# Altium schematic sheet Connectors.SchDoc
size A4; CompanyName: Technische Hochschule Nürnberg Georg Simon Ohm; Organization: UltraZohm; Address1: Kesslerplatz 12; Address2: 90489 Nürnberg; Address3: GERMANY; DocumentNumber: 3; SheetNumber: 2; SheetTotal: 2; Website: www.ultrazohm.com
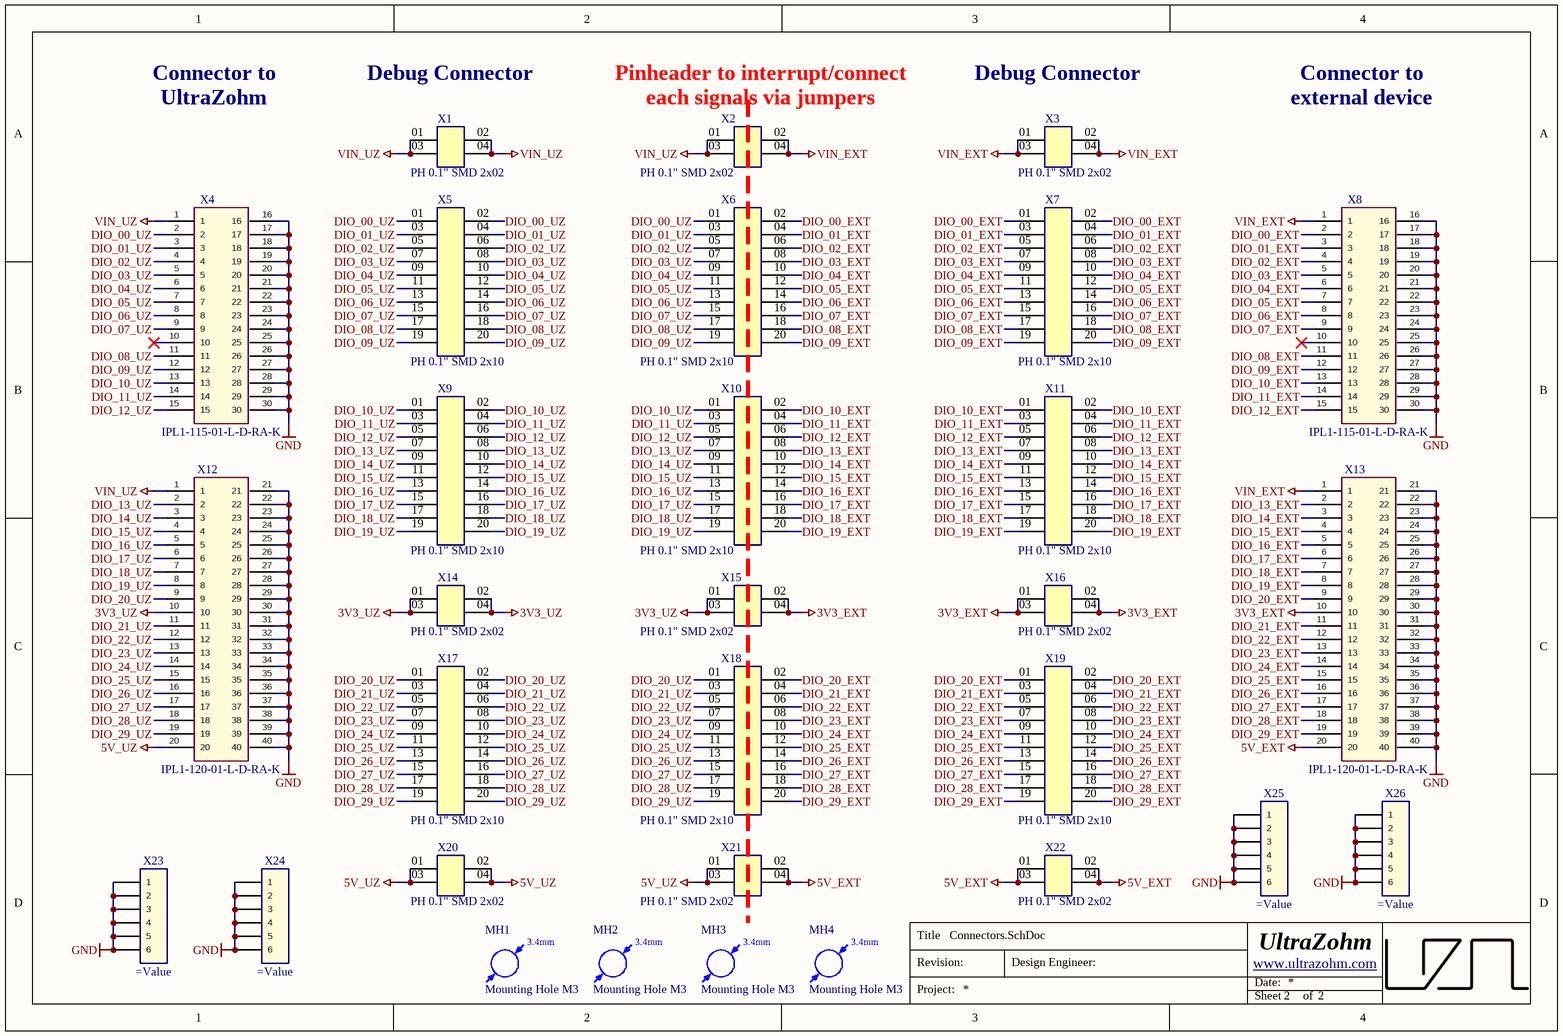
[diagram p0: Connectors.SchDoc]

## Parts
MH1  Mounting Hole M3  [MH_3.4]  (no BOM)
MH2  Mounting Hole M3  [MH_3.4]  (no BOM)
MH3  Mounting Hole M3  [MH_3.4]  (no BOM)
MH4  Mounting Hole M3  [MH_3.4]  (no BOM)
X1  PH 0.1" SMD 2x02  [TSM-102-01-L-DV]
X2  PH 0.1" SMD 2x02  [TSM-102-01-L-DV]
X3  PH 0.1" SMD 2x02  [TSM-102-01-L-DV]
X4  IPL1-115-01-L-D-RA-K  [IPL1-115-01-XX-D-RA]
X5  PH 0.1" SMD 2x10  [TSM-110-01-L-DV]
X6  PH 0.1" SMD 2x10  [TSM-110-01-L-DV]
X7  PH 0.1" SMD 2x10  [TSM-110-01-L-DV]
X8  IPL1-115-01-L-D-RA-K  [IPL1-115-01-XX-D-RA]
X9  PH 0.1" SMD 2x10  [TSM-110-01-L-DV]
X10  PH 0.1" SMD 2x10  [TSM-110-01-L-DV]
X11  PH 0.1" SMD 2x10  [TSM-110-01-L-DV]
X12  IPL1-120-01-L-D-RA-K  [IPL1-120-01-XX-D-RA]
X13  IPL1-120-01-L-D-RA-K  [IPL1-120-01-XX-D-RA]
X14  PH 0.1" SMD 2x02  [TSM-102-01-L-DV]
X15  PH 0.1" SMD 2x02  [TSM-102-01-L-DV]
X16  PH 0.1" SMD 2x02  [TSM-102-01-L-DV]
X17  PH 0.1" SMD 2x10  [TSM-110-01-L-DV]
X18  PH 0.1" SMD 2x10  [TSM-110-01-L-DV]
X19  PH 0.1" SMD 2x10  [TSM-110-01-L-DV]
X20  PH 0.1" SMD 2x02  [TSM-102-01-L-DV]
X21  PH 0.1" SMD 2x02  [TSM-102-01-L-DV]
X22  PH 0.1" SMD 2x02  [TSM-102-01-L-DV]
X23  (no value)  [TSW-106-XX-XXX-S]
X24  (no value)  [TSW-106-XX-XXX-S]
X25  (no value)  [TSW-106-XX-XXX-S]
X26  (no value)  [TSW-106-XX-XXX-S]

## Nets
3V3_EXT: X13.10 X15.02 X15.04 X16.01 X16.02 X16.03 X16.04
3V3_UZ: X12.10 X14.01 X14.02 X14.03 X14.04 X15.01 X15.03
5V_EXT: X13.20 X21.02 X21.04 X22.01 X22.02 X22.03 X22.04
5V_UZ: X12.20 X20.01 X20.02 X20.03 X20.04 X21.01 X21.03
GND: X4.16 X4.17 X4.18 X4.19 X4.20 X4.21 X4.22 X4.23 X4.24 X4.25 X4.26 X4.27 X4.28 X4.29 X4.30 X8.16 X8.17 X8.18 X8.19 X8.20 X8.21 X8.22 X8.23 X8.24 X8.25 X8.26 X8.27 X8.28 X8.29 X8.30 X12.21 X12.22 X12.23 X12.24 X12.25 X12.26 X12.27 X12.28 X12.29 X12.30 X12.31 X12.32 X12.33 X12.34 X12.35 X12.36 X12.37 X12.38 X12.39 X12.40 X13.21 X13.22 X13.23 X13.24 X13.25 X13.26 X13.27 X13.28 X13.29 X13.30 X13.31 X13.32 X13.33 X13.34 X13.35 X13.36 X13.37 X13.38 X13.39 X13.40 X23.1 X23.2 X23.3 X23.4 X23.5 X23.6 X24.1 X24.2 X24.3 X24.4 X24.5 X24.6 X25.1 X25.2 X25.3 X25.4 X25.5 X25.6 X26.1 X26.2 X26.3 X26.4 X26.5 X26.6
VIN_EXT: X2.02 X2.04 X3.01 X3.02 X3.03 X3.04 X8.1 X13.1
VIN_UZ: X1.01 X1.02 X1.03 X1.04 X2.01 X2.03 X4.1 X12.1
DIO_00_EXT: X6.02 X7.01 X7.02 X8.2
DIO_00_UZ: X4.2 X5.01 X5.02 X6.01
DIO_01_EXT: X6.04 X7.03 X7.04 X8.3
DIO_01_UZ: X4.3 X5.03 X5.04 X6.03
DIO_02_EXT: X6.06 X7.05 X7.06 X8.4
DIO_02_UZ: X4.4 X5.05 X5.06 X6.05
DIO_03_EXT: X6.08 X7.07 X7.08 X8.5
DIO_03_UZ: X4.5 X5.07 X5.08 X6.07
DIO_04_EXT: X6.10 X7.09 X7.10 X8.6
DIO_04_UZ: X4.6 X5.09 X5.10 X6.09
DIO_05_EXT: X6.12 X7.11 X7.12 X8.7
DIO_05_UZ: X4.7 X5.11 X5.12 X6.11
DIO_06_EXT: X6.14 X7.13 X7.14 X8.8
DIO_06_UZ: X4.8 X5.13 X5.14 X6.13
DIO_07_EXT: X6.16 X7.15 X7.16 X8.9
DIO_07_UZ: X4.9 X5.15 X5.16 X6.15
DIO_08_EXT: X6.18 X7.17 X7.18 X8.11
DIO_08_UZ: X4.11 X5.17 X5.18 X6.17
DIO_09_EXT: X6.20 X7.19 X7.20 X8.12
DIO_09_UZ: X4.12 X5.19 X5.20 X6.19
DIO_10_EXT: X8.13 X10.02 X11.01 X11.02
DIO_10_UZ: X4.13 X9.01 X9.02 X10.01
DIO_11_EXT: X8.14 X10.04 X11.03 X11.04
DIO_11_UZ: X4.14 X9.03 X9.04 X10.03
DIO_12_EXT: X8.15 X10.06 X11.05 X11.06
DIO_12_UZ: X4.15 X9.05 X9.06 X10.05
DIO_13_EXT: X10.08 X11.07 X11.08 X13.2
DIO_13_UZ: X9.07 X9.08 X10.07 X12.2
DIO_14_EXT: X10.10 X11.09 X11.10 X13.3
DIO_14_UZ: X9.09 X9.10 X10.09 X12.3
DIO_15_EXT: X10.12 X11.11 X11.12 X13.4
DIO_15_UZ: X9.11 X9.12 X10.11 X12.4
DIO_16_EXT: X10.14 X11.13 X11.14 X13.5
DIO_16_UZ: X9.13 X9.14 X10.13 X12.5
DIO_17_EXT: X10.16 X11.15 X11.16 X13.6
DIO_17_UZ: X9.15 X9.16 X10.15 X12.6
DIO_18_EXT: X10.18 X11.17 X11.18 X13.7
DIO_18_UZ: X9.17 X9.18 X10.17 X12.7
DIO_19_EXT: X10.20 X11.19 X11.20 X13.8
DIO_19_UZ: X9.19 X9.20 X10.19 X12.8
DIO_20_EXT: X13.9 X18.02 X19.01 X19.02
DIO_20_UZ: X12.9 X17.01 X17.02 X18.01
DIO_21_EXT: X13.11 X18.04 X19.03 X19.04
DIO_21_UZ: X12.11 X17.03 X17.04 X18.03
DIO_22_EXT: X13.12 X18.06 X19.05 X19.06
DIO_22_UZ: X12.12 X17.05 X17.06 X18.05
DIO_23_EXT: X13.13 X18.08 X19.07 X19.08
DIO_23_UZ: X12.13 X17.07 X17.08 X18.07
DIO_24_EXT: X13.14 X18.10 X19.09 X19.10
DIO_24_UZ: X12.14 X17.09 X17.10 X18.09
DIO_25_EXT: X13.15 X18.12 X19.11 X19.12
DIO_25_UZ: X12.15 X17.11 X17.12 X18.11
DIO_26_EXT: X13.16 X18.14 X19.13 X19.14
DIO_26_UZ: X12.16 X17.13 X17.14 X18.13
DIO_27_EXT: X13.17 X18.16 X19.15 X19.16
DIO_27_UZ: X12.17 X17.15 X17.16 X18.15
DIO_28_EXT: X13.18 X18.18 X19.17 X19.18
DIO_28_UZ: X12.18 X17.17 X17.18 X18.17
DIO_29_EXT: X13.19 X18.20 X19.19 X19.20
DIO_29_UZ: X12.19 X17.19 X17.20 X18.19

Not connected (* = marked no-connect by the designer): X4 10*; X8 10*

## Notes on the sheet
- Connector to UltraZohm
- Debug Connector
- (near X2) Pinheader to interrupt/connect each signals via jumpers
- Connector to external device
- Title
- Revision:
- Design Engineer:
- Date:
- Project:
- Sheet
- of
- (in symbol Mounting Hole) 3.4mm

## Library data of the parts
MH1-MH4 = Mounting Hole: Created from: MHlatky; Manufacturer Part Number: Mounting Hole M3; PartID: 16; Created On: 26.01.2021 09:19:51; ComponentLink1Description: Datasheet; Component Type: Mounting Hole; Device Package: -; Last Updated: 21.03.2022 23:05:12; Manufacturer: Mounting Hole; Supplier 1: Mounting Hole; Supplier Part Number 1: Mounting Hole; Type: Mounting Hole; Value: Mounting Hole; Live Cycle Status: 1; Stock number: not stored
X1-X3 X14-X16 X20-X22 = UZgen_Conn_PinHead_2x02_SMD_100mil_90deg: 0.1" Double-row Pin Header, 90°-to-PCB SMD, 2x02 Pins, 250V, 3A; Manufacturer: UZgen; Pin Pitch: 0.1" x 0.1"; Pin Orientation: 90° (standing); Created from: UZgenTool; Manufacturer Part Number: UZgen_Conn_PinHead_2x02_SMD_100mil_90deg; PartID: 1; Created On: 17.02.2025 17:01:00; Value: PH 0.1" SMD 2x02; Device Package: SMD 0.1" 2x02; Pin Count: 4; Pin Layout: 2x02; Pin Voltage: 250V; Pin Current: 3A; Mounting Type: SMD; Last Updated: 18.02.2025 11:20:45
X4 X8 = IPL1-115-01-L-D-RA-K: Terminal Assembly, Double Row, Right Angle, Thru-Hole, 2.54 mm x 2.54 mm Pitch, 30 Pins; Manufacturer: SAMTEC; Created from: TWendt; Number of positions: 30; Manufacturer Part Number: IPL1-115-01-L-D-RA-K; PartID: 34; Created On: 12.02.2021 15:31:18; ComponentLink1Description: Homepage; ComponentLink1URL: https://www.samtec.com/products/ipl1; Component Type: Samtec Connector; Device Package: Connector; Last Updated: 15.02.2021 10:07:42; Supplier 1: SAMTEC; Supplier Part Number 1: IPL1-115-01-L-D-RA-K; Type: Connector; Live Cycle Status: 1; Number of rows: 2; Stock number: not stored
X5-X7 X9-X11 X17-X19 = UZgen_Conn_PinHead_2x10_SMD_100mil_90deg: 0.1" Double-row Pin Header, 90°-to-PCB SMD, 2x10 Pins, 250V, 3A; Manufacturer: UZgen; Pin Pitch: 0.1" x 0.1"; Pin Orientation: 90° (standing); Created from: UZgenTool; Manufacturer Part Number: UZgen_Conn_PinHead_2x10_SMD_100mil_90deg; PartID: 9; Created On: 18.02.2025 11:27:30; Value: PH 0.1" SMD 2x10; Device Package: SMD 0.1" 2x10; Pin Count: 20; Pin Layout: 2x10; Pin Voltage: 250V; Pin Current: 3A; Mounting Type: SMD; Last Updated: 18.02.2025 11:27:30
X12 X13 = IPL1-120-01-L-D-RA-K: Terminal Assembly, Double Row, Right Angle, Thru-Hole, 2.54 mm x 2.54 mm Pitch, 40 Pins; Manufacturer: SAMTEC; Created from: TWendt; Number of positions: 40; Manufacturer Part Number: IPL1-120-01-L-D-RA-K; PartID: 33; Created On: 12.02.2021 15:26:11; ComponentLink1Description: Homepage; ComponentLink1URL: https://www.samtec.com/products/ipl1; Component Type: Samtec Connector; Device Package: Connector; Last Updated: 15.02.2021 10:07:42; Mounting Type: THT; Supplier 1: SAMTEC; Supplier Part Number 1: IPL1-120-01-L-D-RA-K; Type: Connector; Live Cycle Status: 1; Number of rows: 2; Stock number: not stored
X23-X26 = TSW-106-07-L-S: Classic PCB Header Strips, 0.100" pitch; MPN: TSW-106-07-F-S; MF: SAMTEC; Created from: AGeiger; Created: 2020_12_15_AGeiger; Value: TSW-106-07-L-S; Manufacturer Part Number: TSW-106-07-L-S; PartID: 22; Created On: 26.06.2023 09:53:59; ComponentLink1Description: Datasheet; ComponentLink1URL: https://suddendocs.samtec.com/catalog_english/tsw_th.pdf; Last Updated: 26.06.2023 09:53:59; Manufacturer: SAMTEC; Mounting Type: SMD; Operating Temperature: -55 °C to +105 °C; Series: TSW; Supplier 1: LCSC; Supplier Part Number 1: C492405; LCSC Part Number: C492405